# EAGLE design SECUREBRD_003 (EAGLE 7.7.0)

## Sheet 1 of 3
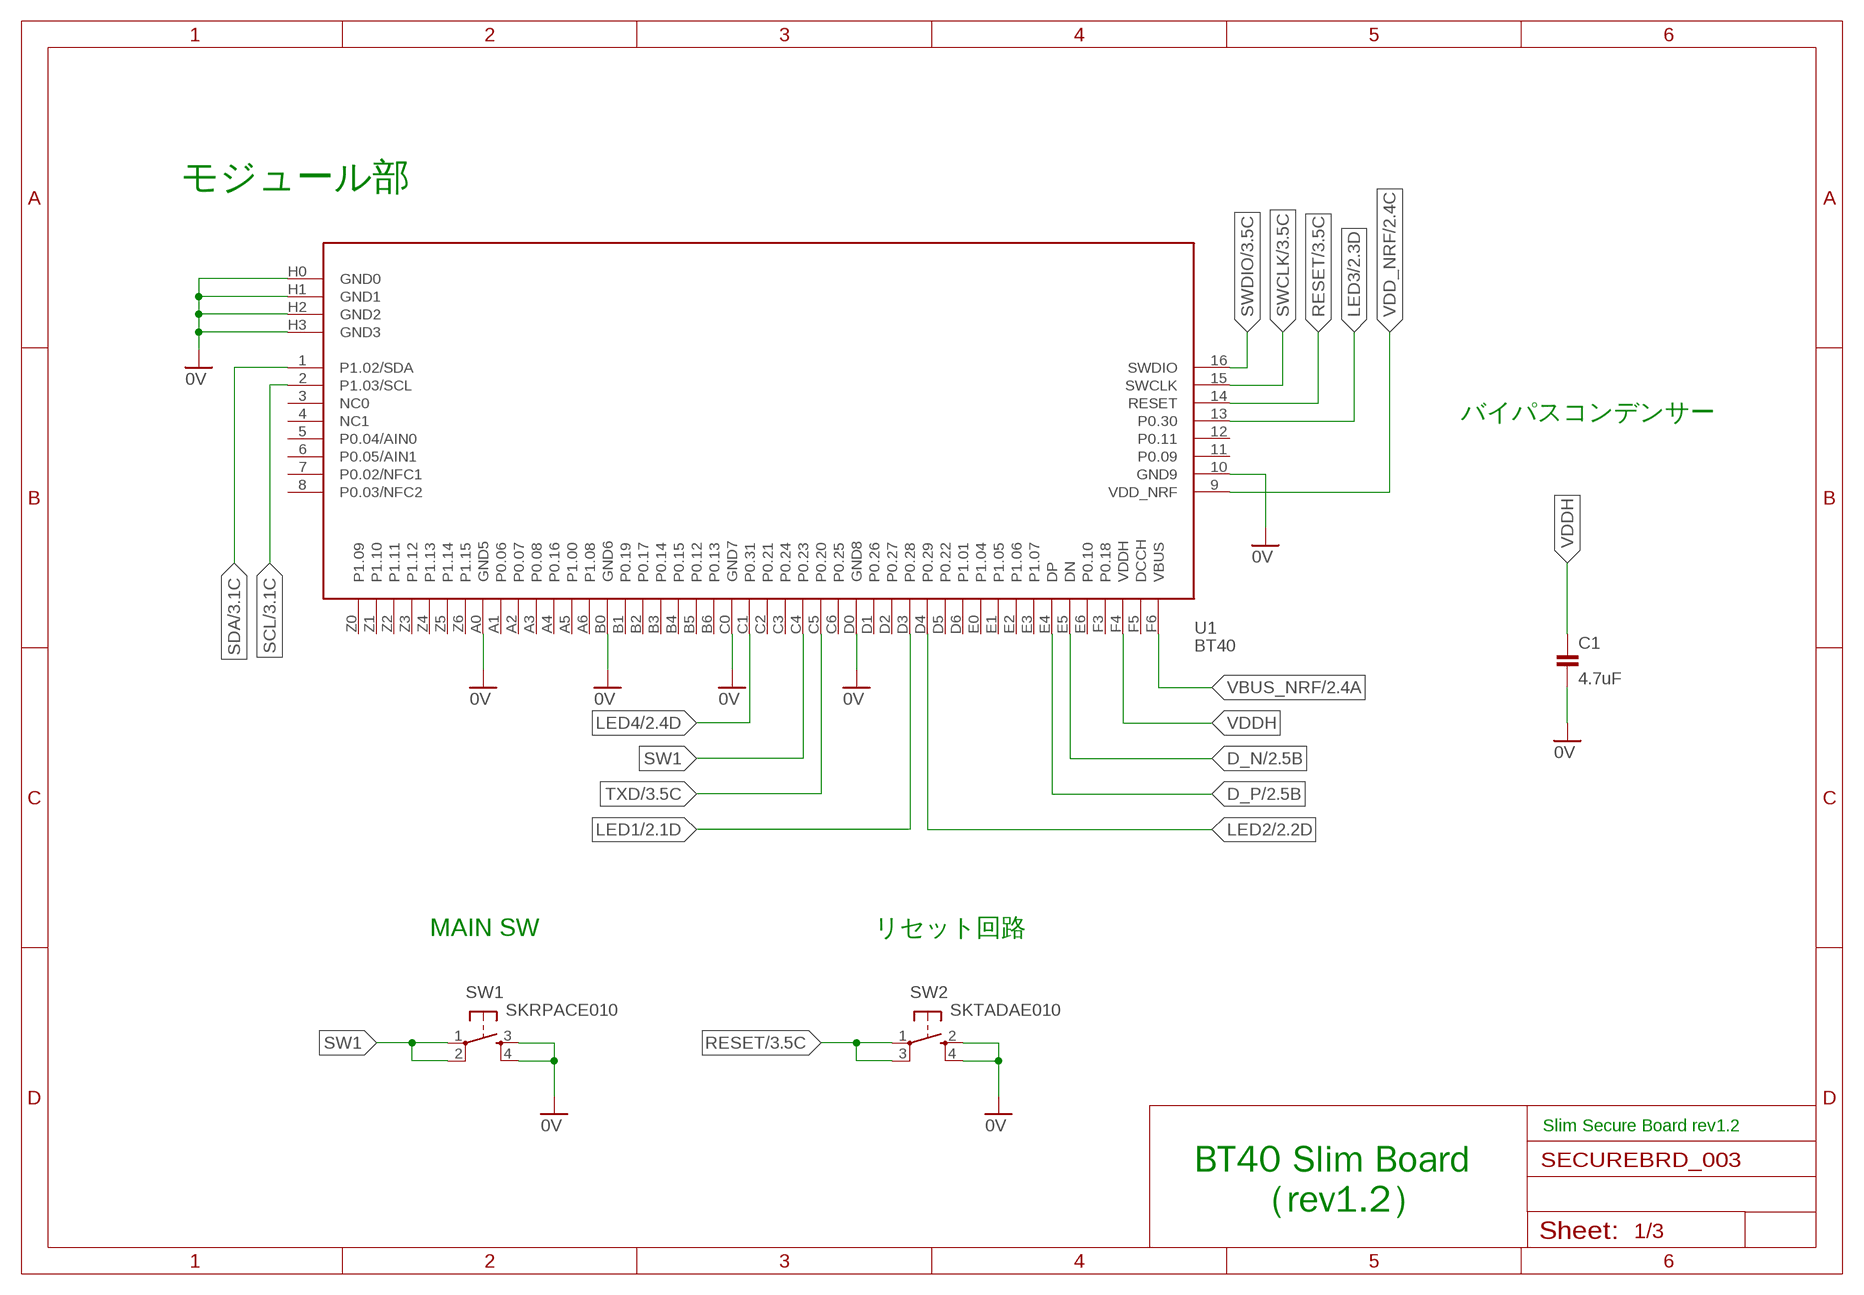
[diagram p0: schematic, sheet 1]

### Parts
C1  4.7uF  CAP_0603  [C0603K]
SW1  SKRPACE010  [SKRPACE010]
SW2  SKTADAE010  [SKTADAE010]
U1  BT40  [BM40-B_1PRIMARY]

### Nets
0V: C1.2 SW1.3(S) SW1.4(S1) SW2.2(S) SW2.4(S1) U1.10(GND9) U1.A0(GND5) U1.B0(GND6) U1.C0(GND7) U1.D0(GND8) U1.H0(GND0) U1.H1(GND1) U1.H2(GND2) U1.H3(GND3) ; also sheet 2,3
D_N: U1.E5(DN) ; also sheet 2
D_P: U1.E4(DP) ; also sheet 2
LED1: U1.D3(P0.28) ; also sheet 2
LED2: U1.D4(P0.29) ; also sheet 2
LED3: U1.13(P0.30) ; also sheet 2
LED4: U1.C1(P0.31) ; also sheet 2
RESET: SW2.1(P) SW2.3(P1) U1.14(RESET) ; also sheet 3
SCL: U1.2(P1.03/SCL) ; also sheet 3
SDA: U1.1(P1.02/SDA) ; also sheet 3
SW1: SW1.1(P) SW1.2(P1) U1.C4(P0.23)
SWCLK: U1.15(SWCLK) ; also sheet 3
SWDIO: U1.16(SWDIO) ; also sheet 3
TXD: U1.C5(P0.20) ; also sheet 3
VBUS_NRF: U1.F6(VBUS) ; also sheet 2
VDD_NRF: U1.9(VDD_NRF) ; also sheet 2,3
VDDH: C1.1 U1.F4(VDDH)
Unconnected: U1.3(NC0) U1.4(NC1) U1.5(P0.04/AIN0) U1.6(P0.05/AIN1) U1.7(P0.02/NFC1) U1.8(P0.03/NFC2) U1.11(P0.09) U1.12(P0.11) U1.A1(P0.06) U1.A2(P0.07) U1.A3(P0.08) U1.A4(P0.16) U1.A5(P1.00) U1.A6(P1.08) U1.B1(P0.19) U1.B2(P0.17) U1.B3(P0.14) U1.B4(P0.15) U1.B5(P0.12) U1.B6(P0.13) U1.C2(P0.21) U1.C3(P0.24) U1.C6(P0.25) U1.D1(P0.26) U1.D2(P0.27) U1.D5(P0.22) U1.D6(P1.01) U1.E0(P1.04) U1.E1(P1.05) U1.E2(P1.06) U1.E3(P1.07) U1.E6(P0.10) U1.F3(P0.18) U1.F5(DCCH) U1.Z0(P1.09) U1.Z1(P1.10) U1.Z2(P1.11) U1.Z3(P1.12) U1.Z4(P1.13) U1.Z5(P1.14) U1.Z6(P1.15)

### Notes on the sheet
- モジュール部
- バイパスコンデンサー
- MAIN SW | リセット回路
- Slim Secure Board rev1.2
- BT40 Slim Board
       （rev1.2）

## Sheet 2 of 3
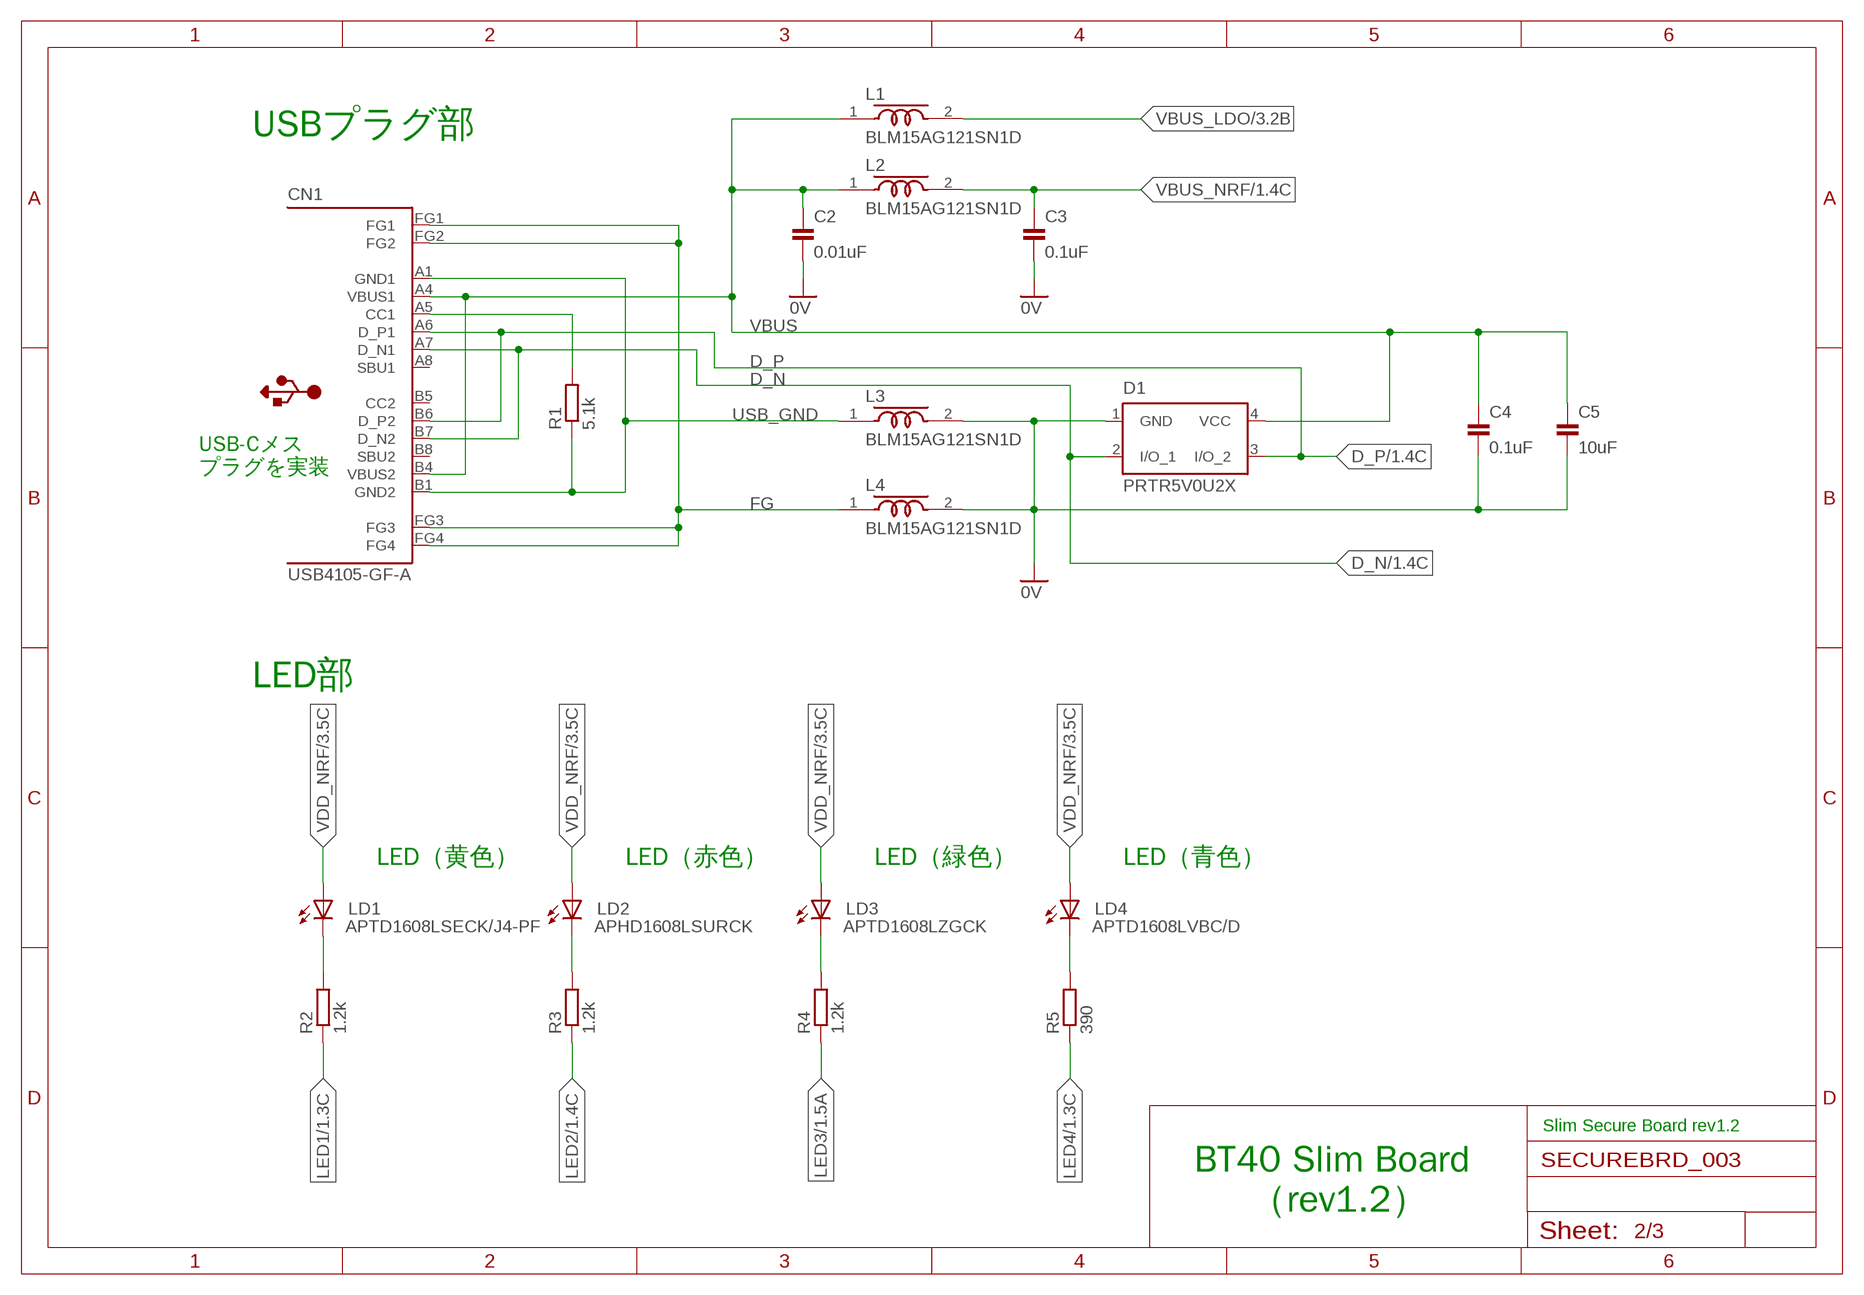
[diagram p1: schematic, sheet 2]

### Parts
C2  0.01uF  CAP_0402K  [C0402K]
C3  0.1uF  CAP_0402K  [C0402K]
C4  0.1uF  CAP_0402K  [C0402K]
C5  10uF  CAP_0603  [C0603K]
CN1  USB4105-GF-A  [USB4105-GF-A]
D1  PRTR5V0U2X  [SOT143B]
L1  BLM15AG121SN1D  [C0402K]
L2  BLM15AG121SN1D  [C0402K]
L3  BLM15AG121SN1D  [C0402K]
L4  BLM15AG121SN1D  [C0402K]
LD1  APTD1608LSECK/J4-PF  [APTD1608]
LD2  APHD1608LSURCK  [APTD1608]
LD3  APTD1608LZGCK  [APTD1608]
LD4  APTD1608LVBC/D  [APTD1608]
R1  5.1k  RESISTOR_0402  [R0402]
R2  1.2k  RESISTOR_0402  [R0402]
R3  1.2k  RESISTOR_0402  [R0402]
R4  1.2k  RESISTOR_0402  [R0402]
R5  390  RESISTOR_0402  [R0402]

### Nets
0V: C2.2 C3.2 C4.2 C5.2 D1.1(GND) L3.2 L4.2 ; also sheet 1,3
D_N: CN1.A7(D_N1) CN1.B7(D_N2) D1.2(I/O_1) ; also sheet 1
D_P: CN1.A6(D_P1) CN1.B6(D_P2) D1.3(I/O_2) ; also sheet 1
FG: CN1.FG1 CN1.FG2 CN1.FG3 CN1.FG4 L4.1
LED1: R2.1 ; also sheet 1
LED2: R3.1 ; also sheet 1
LED3: R4.1 ; also sheet 1
LED4: R5.1 ; also sheet 1
N$1: LD4.C R5.2
N$2: CN1.A5(CC1) R1.2
N$6: LD3.C R4.2
N$7: LD2.C R3.2
N$8: LD1.C R2.2
USB_GND: CN1.A1(GND1) CN1.B1(GND2) L3.1 R1.1
VBUS: C2.1 C4.1 C5.1 CN1.A4(VBUS1) CN1.B4(VBUS2) D1.4(VCC) L1.1 L2.1
VBUS_LDO: L1.2 ; also sheet 3
VBUS_NRF: C3.1 L2.2 ; also sheet 1
VDD_NRF: LD1.A LD2.A LD3.A LD4.A ; also sheet 1,3
Unconnected: CN1.A8(SBU1) CN1.B5(CC2) CN1.B8(SBU2)

### Notes on the sheet
- USBプラグ部
- USB-Cメス
  プラグを実装
- LED部
- LED（黄色） | LED（赤色） | LED（緑色） | LED（青色）
- Slim Secure Board rev1.2
- BT40 Slim Board
       （rev1.2）

## Sheet 3 of 3
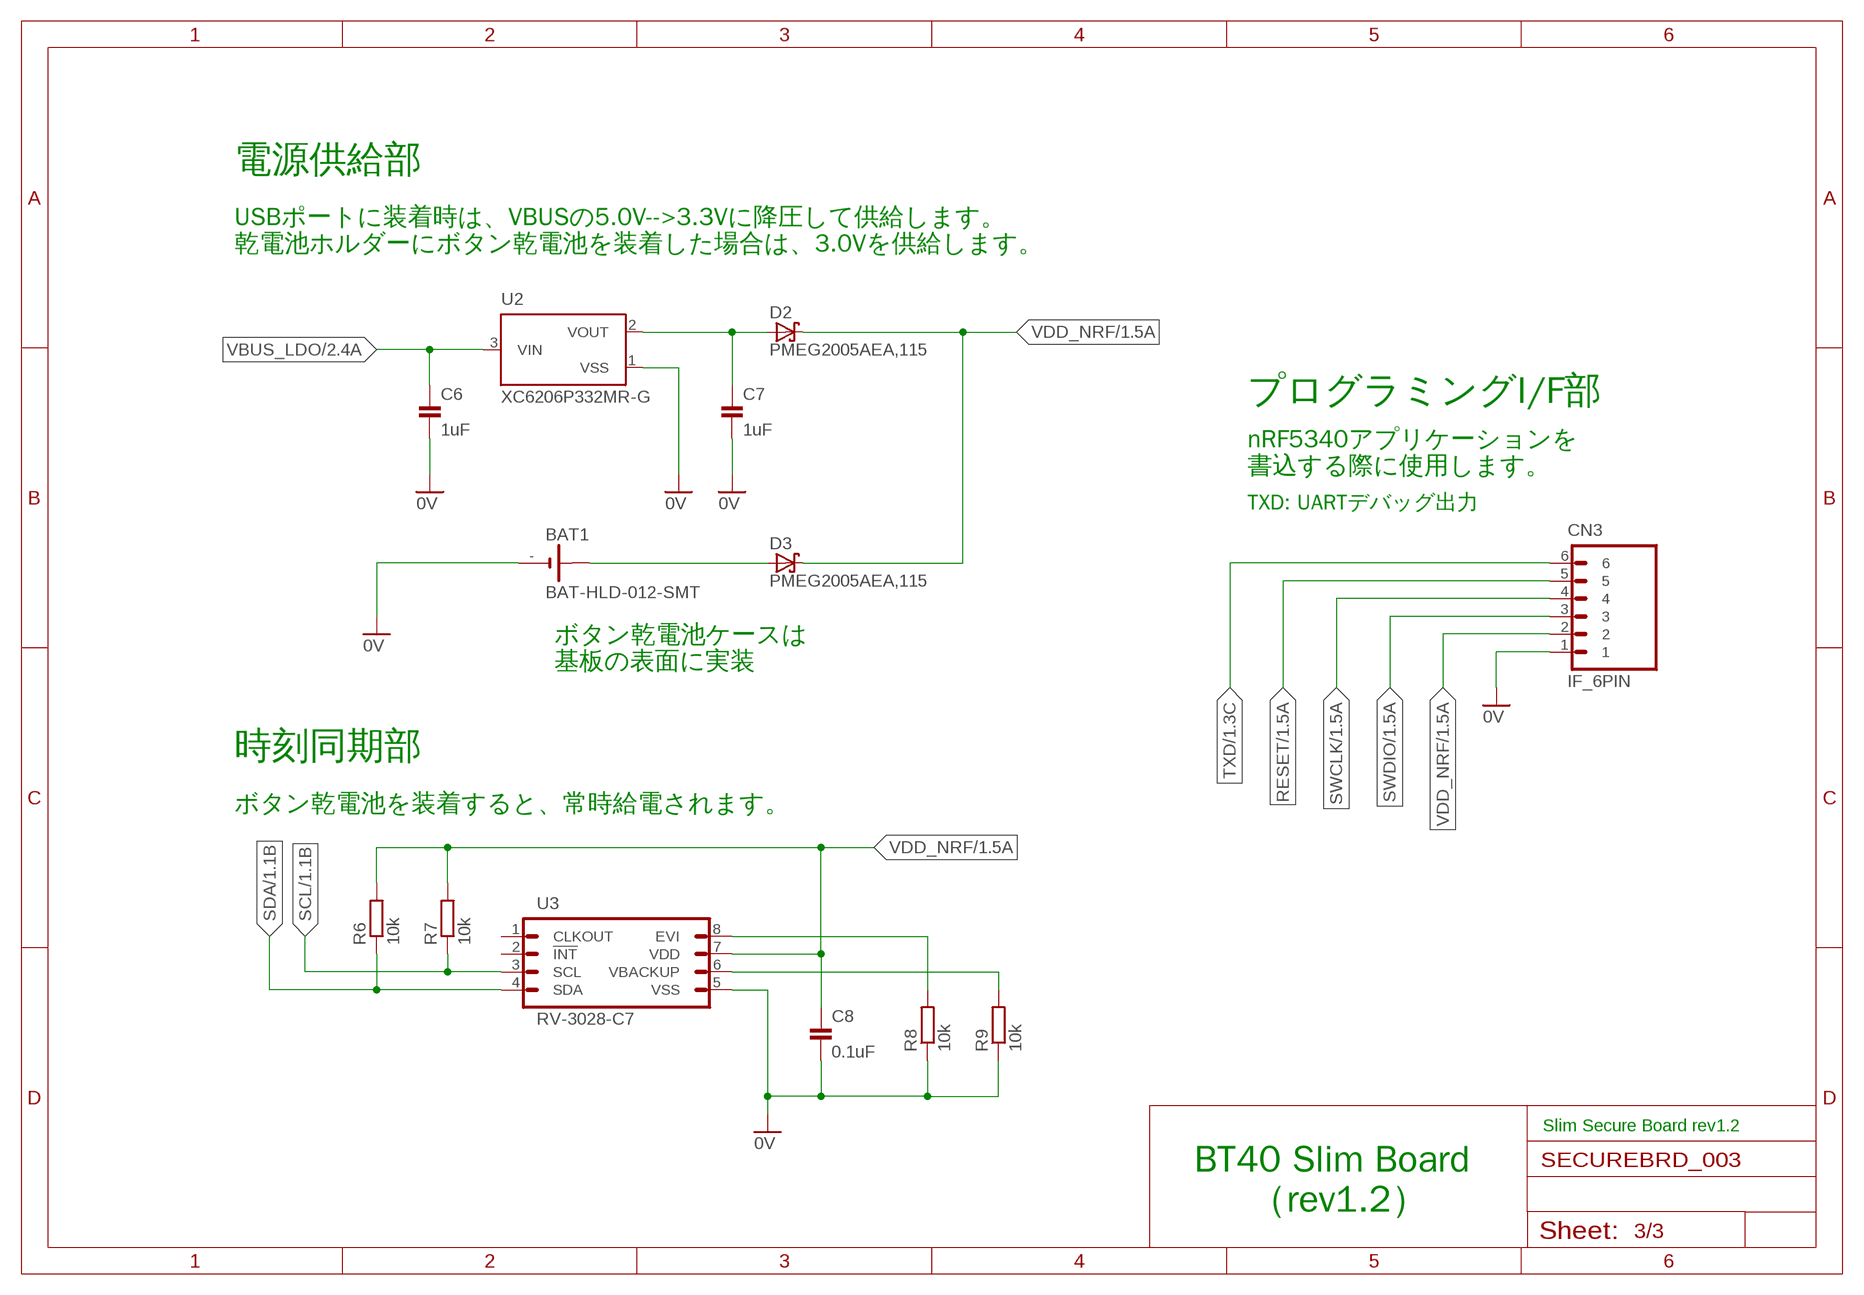
[diagram p2: schematic, sheet 3]

### Parts
BAT1  BAT-HLD-012-SMT  [BAT-HLD-012-SMT]
C6  1uF  CAP_0603  [C0603K]
C7  1uF  CAP_0603  [C0603K]
C8  0.1uF  CAP_0402K  [C0402K]
CN3  IF_6PIN  [HEADER_6PIN]
D2  PMEG2005AEA,115  [SOD323-W]
D3  PMEG2005AEA,115  [SOD323-W]
R6  10k  RESISTOR_0402  [R0402]
R7  10k  RESISTOR_0402  [R0402]
R8  10k  RESISTOR_0402  [R0402]
R9  10k  RESISTOR_0402  [R0402]
U2  XC6206P332MR-G  [SOT23]
U3  RV-3028-C7  [SON-8]

### Nets
0V: BAT1.- C6.2 C7.2 C8.2 CN3.1 R8.1 R9.1 U2.1(VSS) U3.5(VSS) ; also sheet 1,2
N$4: C7.1 D2.A U2.2(VOUT)
N$9: R9.2 U3.6(VBACKUP)
N$10: R8.2 U3.8(EVI)
RESET: CN3.5 ; also sheet 1
SCL: R7.1 U3.3(SCL) ; also sheet 1
SDA: R6.1 U3.4(SDA) ; also sheet 1
SWCLK: CN3.4 ; also sheet 1
SWDIO: CN3.3 ; also sheet 1
TXD: CN3.6 ; also sheet 1
VBUS_LDO: C6.1 U2.3(VIN) ; also sheet 2
VDD_BAT: BAT1.+@2(+) D3.A
VDD_NRF: C8.1 CN3.2 D2.C D3.C R6.2 R7.2 U3.7(VDD) ; also sheet 1,2
Unconnected: U3.1(CLKOUT) U3.2(!INT!)

### Notes on the sheet
- 電源供給部
- USBポートに装着時は、VBUSの5.0V-->3.3Vに降圧して供給します。
  乾電池ホルダーにボタン乾電池を装着した場合は、3.0Vを供給します。
- プログラミングI/F部
- nRF5340アプリケーションを
  書込する際に使用します。
- TXD: UARTデバッグ出力
- ボタン乾電池ケースは
  基板の表面に実装
- 時刻同期部
- ボタン乾電池を装着すると、常時給電されます。
- Slim Secure Board rev1.2
- BT40 Slim Board
       （rev1.2）

## Library data of the parts
BAT1 = Connectors:BAT-HLD-012-SMT: ボタン電池ホルダー(CR1216/1225)
C1-C8 = Parts:CAP: コンデンサー
CN1 = Connectors:USB4105-GF-A: USB Type C Receptacle for USB 2.0
CN3 = Connectors:IF_6PIN: 6-pin インターフェース
D1 = Parts:PRTR5V0U2X: ESD protection diode
D2 D3 = Parts:PMEG2005: ショットキーダイオード If - 順電流: 500 mA Vrrm - 繰返し逆電圧: 20 V Vf - 順電圧: 0.39 V Ifsm - 順方向サージ電流: 10 A 最低動作温度: - 65 C 最高動作温度: + 150 C
L1-L4 = Parts:BLM15AG: フェライトビーズ EMIFIL®
LD1 LD3 LD4 = Parts:APTD1608: 発光ダイオード
LD2 = Parts:APHD1608: 発光ダイオード
R1-R9 = Parts:RESISTOR: 抵抗器
SW1 = Parts:SKRPACE010: 表面実装用タクトスイッチ ４．２×３．２ｍｍ小型重作動力タイプ ・作動力：２．５５Ｎ ・操作方向：垂直 ・移動量：０．２ｍｍ ・動作寿命：５０，０００ｃｙｃｌｅｓ （５ｍＡ ５ＶＤＣ） ・初期接触抵抗：最大５００ｍΩ
SW2 = Parts:SKTADAE010: 表面実装用タクトスイッチ 2.6×1.6ｍｍ小型重作動力タイプ ・作動力：2.4 N ・操作方向：垂直 ・移動量：0.11 mm ・定格：50 mA 12 VDC
U1 = Modules:BT40: BLE 5.2, 802.15.4 Modules ・nRF5340 QKAA, dual core ARM® Cortex M33 ・128/64 MHz Cortex M33 with FPU and DSP instructions ・1MB flash, 512KB RAM ・DC-DC converter, inductors for VDD, VDDH on board. ・Direct powered by Lithium batteries or USB supply (up to 5.5V)
U2 = Parts:XC6206: 電圧レギュレータ 出力電圧: 3.3 V 出力電流: 200 mA 入力電圧最大値: 6 V 最小入力電圧: 1.8 V 動作供給電流: 1 uA 最低動作温度: - 40 C 最高動作温度: + 85 C
U3 = ICs:RV-3028-C7: Extreme Low Power RTC Module Supply Voltage: 1.2 V 〜 5.5 V Operating Temperature: - 40 C 〜 + 85 C 3.2 mm x 1.5 mm

## Board
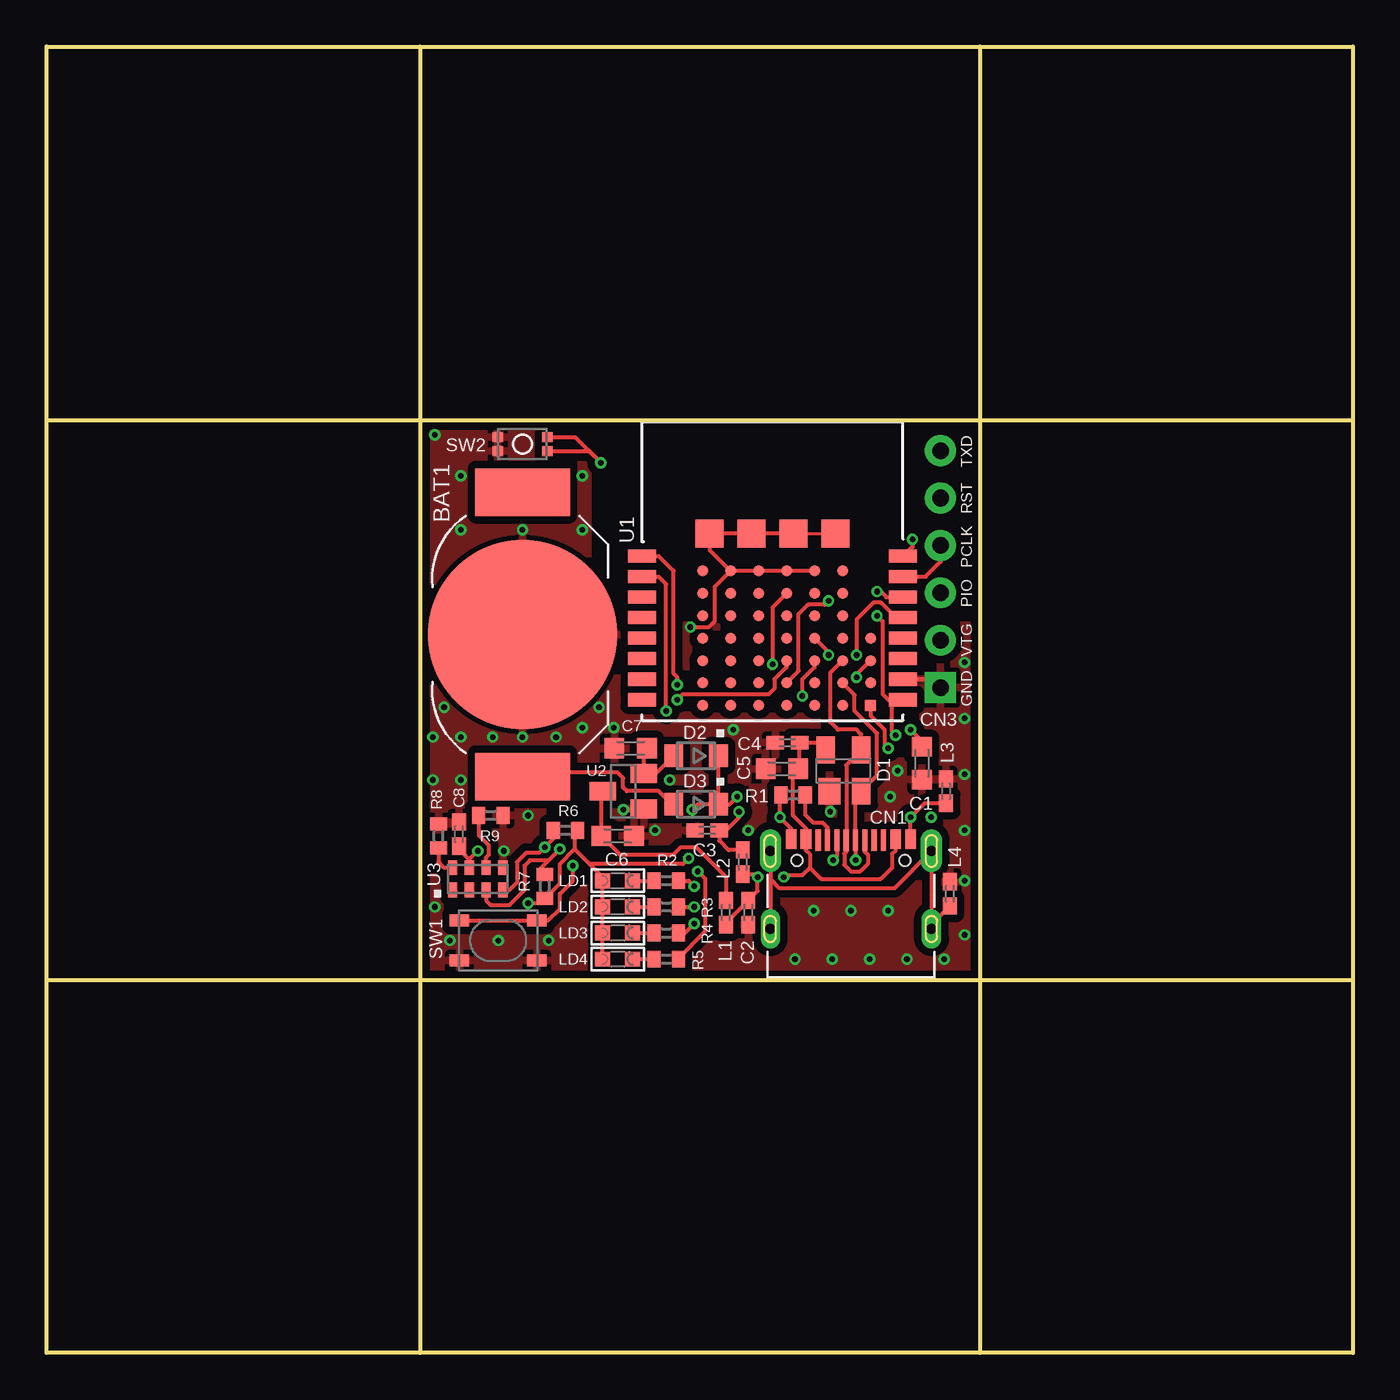
[diagram p3: board, top side]
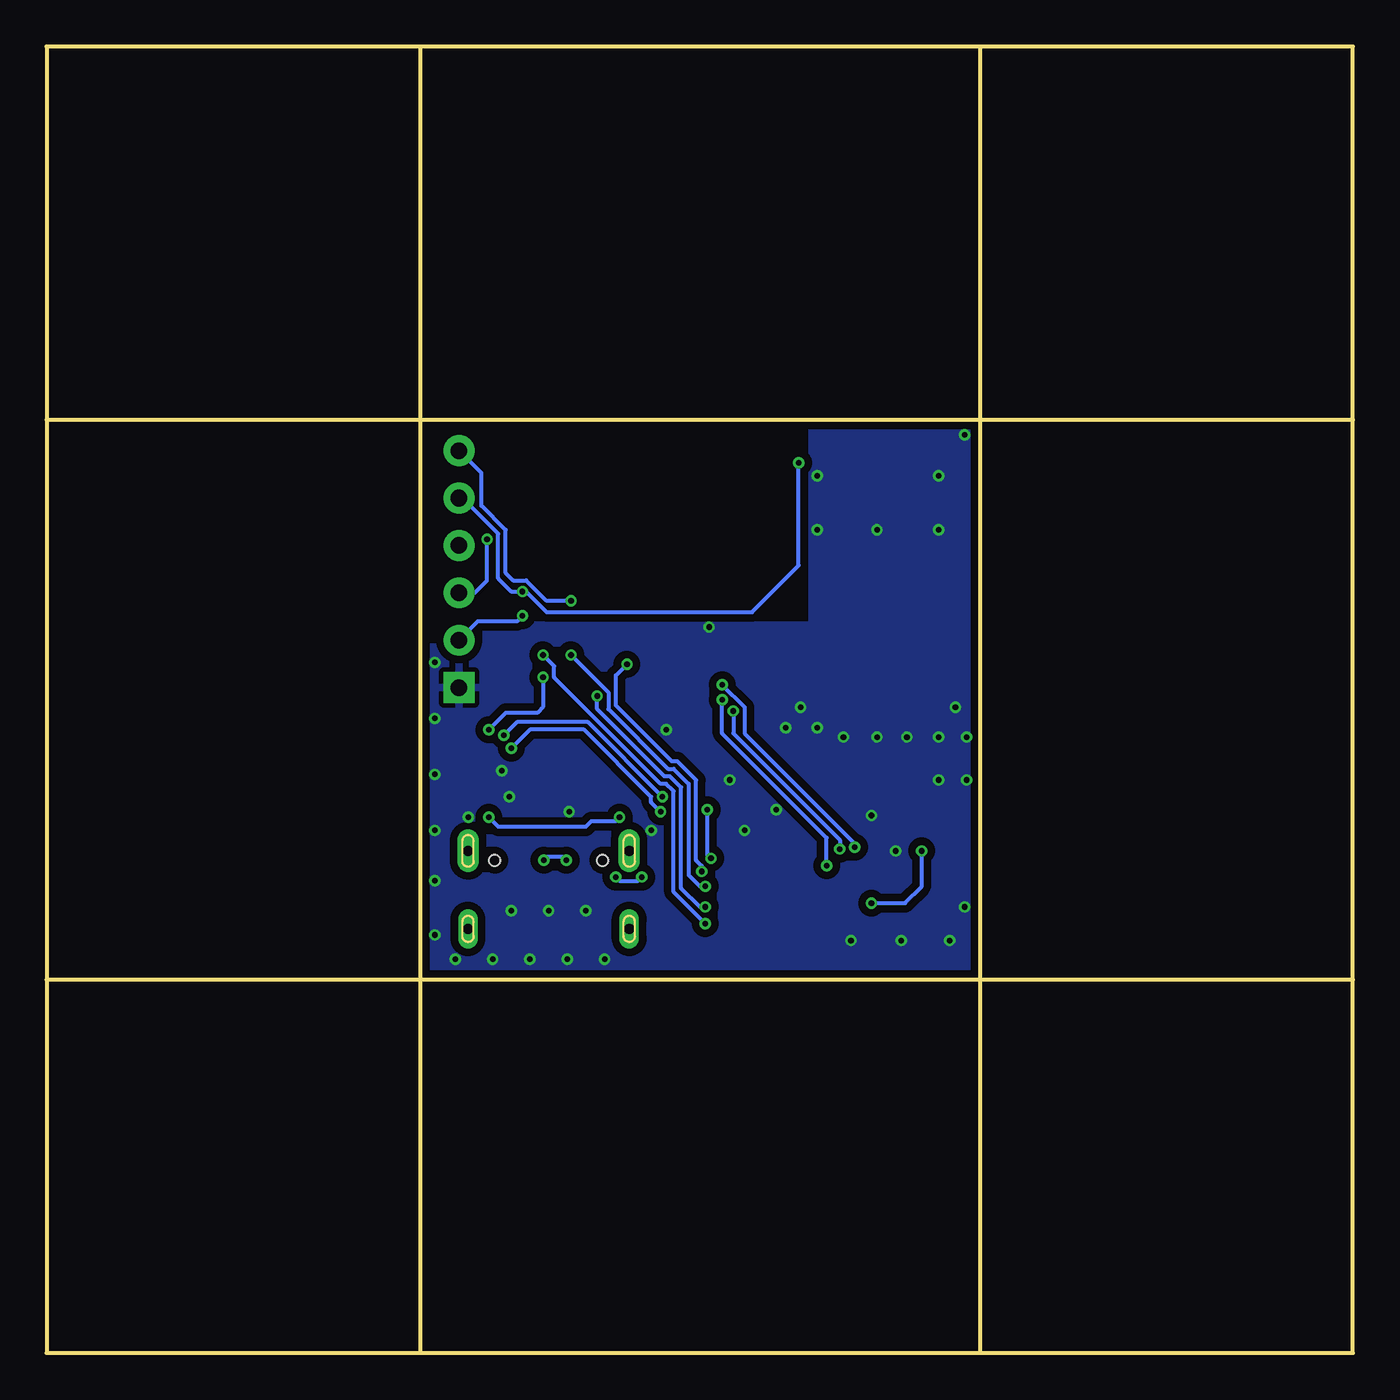
[diagram p4: board, bottom side, seen from below]

Size 70 x 70 mm. Coordinates in mm from the lower left corner, seen from the top.
Outline: 0,20 0,0 20,0
Outline: 0,20 0,50
Outline: 0,50 0,70 20,70
Outline: 20,70 50,70
Outline: 50,70 70,70 70,50
Outline: 70,50 70,20
Outline: 70,20 70,0 50,0
Outline: 50,0 20,0
Outline: 0,50 70,50
Outline: 0,20 70,20
Outline: 20,70 20,0
Outline: 50,70 50,0
Copper layers (1*16): Top 0.035mm / dielectric 1.5mm / Bottom 0.035mm
Design rules "SeeedStudio_2layer_DRU_no_angle_20140221 *": minimum track width 6mil, minimum drill 0.3mm, track to track 6mil, track to pad 6mil, pad to pad 6mil, via to via 6mil, smd to smd 0mil, copper to edge 10mil, drill to drill 10mil, minimum pad ring 4mil, minimum via ring 6mil, stop-mask expansion 2mil, vias tented up to drill 100mil, thermal gap 10mil

### Footprints (pad centres in the part's own frame; a part is rotated, then mirrored left to right if it is on the bottom)
BAT-HLD-012-SMT = smd 2.54 x 5.08: +@1 -7.62,0; +@2 7.62,0 | smd 10.16 x 10.16: - 0,0
C0603K = smd 1.05 x 1.08: 1 -0.875,0; 2 0.875,0
C0402K = smd 0.925 x 0.74: 1 -0.65,0; 2 0.65,0
USB4105-GF-A = smd 0.58 x 1.05: A1 -3.2,0.625; A4 -2.4,0.625; B1 3.2,0.625; B4 2.4,0.625 | smd 0.28 x 1.15: A5 -1.25,0.575; A6 -0.25,0.575; A7 0.25,0.575; A8 1.25,0.575; B5 1.75,0.575; B6 0.75,0.575; B7 -0.75,0.575; B8 -1.75,0.575 | drill 0.55 pad 1.15 long: FG1 -4.32,0; FG3 4.32,0 | drill 0.55 pad 1.05 long: FG2 -4.32,-4.18; FG4 4.32,-4.18 | hole 0.6: -2.89,-0.5; 2.89,-0.5
HEADER_6PIN = drill 0.889 pad 1.651 square: 1 -6.35,0 | drill 0.889 pad 1.651: 2 -3.81,0; 3 -1.27,0; 4 1.27,0; 5 3.81,0; 6 6.35,0
SOT143B = smd 1.2 x 1.44: 1 -0.75,-1.1 | smd 1 x 1.44: 2 0.95,-1.1; 3 0.95,1.1; 4 -0.95,1.1
SOD323-W = smd 1 x 1.2: A 1.2,0; C -1.2,0
APTD1608 = smd 0.8 x 0.8: A -0.8,0; C 0.8,0
R0402 = smd 0.7 x 0.9: 1 -0.65,0; 2 0.65,0
SKRPACE010 = smd 1.05 x 0.65: 1 -2.075,1.075; 2 2.075,1.075; 3 -2.075,-1.075; 4 2.075,-1.075
SKTADAE010 = smd 0.55 x 0.55: 1 -1.325,0.375; 2 1.325,0.375; 3 -1.325,-0.375; 4 1.325,-0.375
BM40-B_1PRIMARY = smd 1.5 x 0.7: 1 0,8.8; 2 0,7.7; 3 0,6.6; 4 0,5.5; 5 0,4.4; 6 0,3.3; 7 0,2.2; 8 0,1.1; 9 14,1.1; 10 14,2.2; 11 14,3.3; 12 14,4.4; 13 14,5.5; 14 14,6.6; 15 14,7.7; 16 14,8.8 | smd 0.6 x 0.6: A0 4.75,8; A1 4.75,6.8; A2 4.75,5.6; A3 4.75,4.4; A4 4.75,3.2; A5 4.75,2; A6 4.75,0.8; B0 6.25,8; B1 6.25,6.8; B2 6.25,5.6; B3 6.25,4.4; B4 6.25,3.2; B5 6.25,2; B6 6.25,0.8; C0 7.75,8; C1 7.75,6.8; C2 7.75,5.6; C3 7.75,4.4; C4 7.75,3.2; C5 7.75,2; C6 7.75,0.8; D0 9.25,8; D1 9.25,6.8; D2 9.25,5.6; D3 9.25,4.4; D4 9.25,3.2; D5 9.25,2; D6 9.25,0.8; E0 10.75,8; E1 10.75,6.8; E2 10.75,5.6; E3 10.75,4.4; E4 10.75,3.2; E5 10.75,2; E6 10.75,0.8; F3 12.25,4.4; F4 12.25,3.2; F5 12.25,2; F6 12.25,0.8; Z0 3.25,8; Z1 3.25,6.8; Z2 3.25,5.6; Z3 3.25,4.4; Z4 3.25,3.2; Z5 3.25,2; Z6 3.25,0.8 | smd 1.5 x 1.5: H0 3.625,10; H1 5.875,10; H2 8.125,10; H3 10.375,10
SOT23 = smd 1 x 1.4: 1 -0.95,-1.1; 2 0.95,-1.1; 3 0,1.1
SON-8 = smd 0.5 x 0.8: 1 0.25,0.4; 2 1.15,0.4; 3 2.05,0.4; 4 2.95,0.4; 5 2.95,1.6; 6 2.05,1.6; 7 1.15,1.6; 8 0.25,1.6

### Placement (x,y rotation side)
BAT1  25.5,38.5 270 top
C1  46.9,31.6 270 top
C2  37.6,23.6 270 top
C3  35.4,28 180 top
C4  39.7,32.7 180 top
C5  39.4,31.3 180 top
C6  30.6,27.7 0 top
C7  31.3,32.4 180 top
C8  22.1,27.8 90 top
CN1  43.1,26.9 0 top
CN3  47.9,42 90 top
D1  42.7,31.2 0 top
D2  34.8,32 180 top
D3  34.8,29.4 180 top
L1  36.4,23.6 90 top
L2  37.3,26.3 90 top
L3  48.2,30.1 90 top
L4  48.4,24.6 90 top
LD1  30.6,25.3 0 top
LD2  30.6,23.9 0 top
LD3  30.6,22.5 0 top
LD4  30.6,21.1 0 top
R1  40,29.9 0 top
R2  33.2,25.3 180 top
R3  33.2,23.9 180 top
R4  33.2,22.5 180 top
R5  33.2,21.1 180 top
R6  27.8,28 0 top
R7  26.7,25 270 top
R8  21,27.7 270 top
R9  23.8,28.8 180 top
SW1  24.2,22.1 0 top
SW2  25.5,48.7 180 top
U1  31.9,33.9 0 top
U2  30.9,30.1 90 top
U3  21.5,24.4 0 top

### Tracks (layer width: path | path; a pad name or v marks a point on that pad's centre or on a via)
0V  (via drill 0.3)
  Top 0.152: U1.H2 U1.H3
  Top 0.203: U1.A0 35.8,41.05 35.8,39.2 35.5,38.9 v34.5,38.9 | U1.D0 U1.C0 U1.B0 U1.A0 | U1.A0 35.52,43.02 U1.H0 U1.H1 U1.H2 | U1.10 47.45,36.1 CN3.1 | U2.1 32.15,29.15 32.1,29.1 v30.9,29.1 | 31.68,27.5 C6.2
  other vias: 42,29 49.2,28 32.6,28 36.8,33.4 45.2,29.8 42.1,21.1 46.1,21.1 40.1,21.1 44.1,21.1 43.1,23.7 45.1,23.7 41.1,23.7 45.6,31.2 48.1,21.1 30.4,33.5 22.2,33 22.2,30.7 20.8,23.9 26.9,22.1 24.2,22.1 21.6,22.1 24.5,26.9 25.8,28.8 27.3,33 49.2,37 49.2,34 49.2,31 49.2,25.3 49.2,22.4 28.7,33.5 25.5,33 20.7,30.7 20.7,33 21.3,34.6 29.6,34.6 22.2,44.1 25.5,44.1 28.7,44.1 28.7,47 22.2,47 20.8,49.2 37.6,28 47.4,28.7 33.4,30.7 23.9,33
  pour Bottom (isolate 0.406, rank 3): 29,51 29,39 51,39 51,19 19,19 19,51
  pour Top (isolate 0.406, rank 3): 18,52 29,52 29,39 52,39 52,18 18,18
D_N  (via drill 0.3)
  Top 0.203: v43.35,26.4 CN1.A7 43.35,29.8 D1.2 44.5,30.95 44.5,33.2 43.3,34.4 43.3,35.25 U1.E5 | CN1.B7 42.35,26.6 v42.15,26.4
  Bottom 0.203: v42.15,26.4 42.35,26.6 43.15,26.6 v43.35,26.4
D_P
  Top 0.203: CN1.B6 43.85,26.85 44,26.7 44,26.2 43.6,25.8 43.1,25.8 42.75,26.15 42.75,26.75 42.85,26.85 CN1.A6 42.85,31.5 D1.3 43.65,33.15 43.4,33.4 42.4,33.4 42,33.8 42,36.45 U1.E4
FG
  Top 0.203: 38.78,25.4 CN1.FG1 38.78,26.82 | 38.78,25.4 CN1.FG2 | 38.78,25.4 39.28,24.9 45.42,24.9 CN1.FG3 CN1.FG4 47.42,22.97 L4.1
LED1  (via drill 0.3)
  Top 0.203: R2.1 34.4,25.3 v34.7,25 | v41.9,37.4 41.9,37.55 U1.D3
  Bottom 0.203: v41.9,37.4 39.9,35.4 39.9,34.5 36.7,31.3 36.4,31.3 35.6,30.5 35.6,25.6 35,25 v34.7,25
LED2  (via drill 0.3)
  Top 0.203: R3.1 v34.7,23.9 | v40.5,35.2 40.5,36.1 41.15,36.75 U1.D4
  Bottom 0.203: v34.7,23.9 35,23.9 36,24.9 36,30.3 36.6,30.9 36.9,30.9 40.5,34.5 v40.5,35.2
LED3  (via drill 0.3)
  Top 0.203: R4.1 34.2,22.5 v34.7,23 | U1.13 45.5,39.4 44.7,40.2 44.3,40.2 43.4,39.3 v43.4,37.4
  Bottom 0.203: v34.7,23 36.4,24.7 36.4,30.1 36.8,30.5 37.1,30.5 42.8,36.2 42.8,36.8 v43.4,37.4
LED4  (via drill 0.3)
  Top 0.203: R5.1 33.85,21.15 35.3,22.6 35.3,25.4 v34.9,25.8 | U1.C1 38.9,39.95 v38.9,36.9
  Bottom 0.203: v34.9,25.8 34.9,26.1 35.2,26.4 35.2,30.7 36.2,31.7 36.5,31.7 39.5,34.7 39.5,36.3 v38.9,36.9
N$1
  Top 0.203: LD4.C R5.2
N$2
  Top 0.203: CN1.A5 41.85,28.15 41.6,28.4 41.1,28.4 40.65,28.85 R1.2
N$4
  Top 0.203: D2.A 32.65,31.05 U2.2 32,32.23 C7.1
N$6
  Top 0.203: LD3.C R4.2
N$7
  Top 0.203: LD2.C R3.2
N$8
  Top 0.203: LD1.C R2.2
N$9
  Top 0.203: U3.6 23.55,26.55 23.7,26.7 23.7,27.2 23.15,27.75 R9.2
N$10
  Top 0.203: U3.8 21.3,26 21,26.3 R8.2
RESET  (via drill 0.3)
  Top 0.203: SW2.3 28.32,49.08 v29.7,47.7 29.07,48.33 SW2.1 | v44.5,40.8 44.7,40.8 45,40.5 U1.14
  Bottom 0.203: v29.7,47.7 29.7,42.2 32.2,39.7 43.2,39.7 44.3,40.8 v44.5,40.8 45.1,40.8 45.8,41.5 45.8,43.9 47.71,45.81 CN3.5
SCL  (via drill 0.3)
  Top 0.203: U3.3 23.55,24.25 23.8,24 24.8,24 25.6,24.8 25.6,26.1 25.9,26.4 26.9,26.4 | 26.9,26.4 26.5,26 R7.1 | v33.2,34.4 33.2,41.2 32.8,41.6 U1.2 | 26.9,26.4 v27.5,27
  Bottom 0.203: v33.2,34.4 33.2,33.2 27.5,27.5 v27.5,27
SDA  (via drill 0.3)
  Top 0.203: U3.4 24.8,24.8 25.2,25.2 25.2,26.3 25.7,26.8 26.4,26.8 v26.7,27.1 27.15,27.55 R6.1 | v33.8,35.8 33.8,36.2 33.6,36.4 33.6,41.9 32.8,42.7 U1.1
  Bottom 0.203: v33.8,35.8 32.6,34.6 32.6,33.2 26.7,27.3 v26.7,27.1
SW1  (via drill 0.3)
  Top 0.203: SW1.1 SW1.2 26.88,23.18 27.5,23.8 27.5,24.6 28.2,25.3 v28.2,26.1 | v33.8,35 34.1,35.3 38.7,35.3 39,35.6 39,36.1 39.65,36.75 U1.C4
  Bottom 0.203: v33.8,35 33.8,33.2 28.2,27.6 v28.2,26.1
SWCLK
  Top 0.203: U1.15 47.1,41.6 47.9,42.4 CN3.4
SWDIO  (via drill 0.3)
  Top 0.203: v46.4,43.6 46.4,43.2 U1.16
  Bottom 0.203: v46.4,43.6 46.4,41.4 47.07,40.73 CN3.3
TXD  (via drill 0.3)
  Top 0.203: U1.C5 40.3,36.55 40.3,39.6 40.8,40.1 41.7,40.1 v41.9,40.3
  Bottom 0.203: v41.9,40.3 43.2,40.3 44.3,41.4 45,41.4 45.4,41.8 45.4,44.1 46.7,45.4 46.7,47.15 CN3.6
USB_GND  (via drill 0.3)
  Top 0.203: CN1.B1 v46.3,28.7 | 46.5,28.9 v46.3,28.7 | CN1.A1 39.9,28.1 v39.3,28.7 39.3,29.85 R1.1 | L3.1 47.05,29.45 v46.3,28.7
  Bottom 0.203: v46.3,28.7 45.8,28.2 41.1,28.2 40.8,28.5 39.5,28.5 v39.3,28.7
VBUS  (via drill 0.3)
  Top 0.203: 40.9,26 40.9,26.73 40.7,26.93 CN1.A4 40.7,28.1 40,28.8 40,31.02 C5.1 40.35,31.38 C4.1 41.35,32.7 D1.4 | 40.9,26 41.5,25.4 44.7,25.4 45.3,26 45.3,26.73 45.5,26.93 CN1.B4 | 40.9,26 40.5,25.6 39.6,25.6 v39.5,25.5 | L2.1 37.95,25.65 v38.1,25.5 38.1,24.75 C2.1 36.4,23.05 L1.1
  Bottom 0.203: v38.1,25.5 38.3,25.3 39.3,25.3 v39.5,25.5
VBUS_LDO
  Top 0.203: U2.3 29.73,30.02 C6.1 30.73,26.7 33.6,26.7 34,27.1 34.8,27.1 36.4,25.5 L1.2
VBUS_NRF  (via drill 0.3)
  Top 0.203: U1.F6 44.15,34.15 44.9,33.4 44.9,32.6 v45.1,32.4 | v37.1,29 37.1,28.7 36.4,28 C3.1 36.05,27.45 36.55,26.95 L2.2
  Bottom 0.203: v37.1,29 37.6,29.5 37.6,29.8 41.2,33.4 44.1,33.4 v45.1,32.4
VDD_BAT
  Top 0.203: 24.75,30.33 BAT1.+@2 25.72,31.1 30.6,31.1 30.9,30.8 30.9,30.3 31.1,30.1 32.8,30.1 33.4,29.5 33.5,29.5 D3.A
VDD_NRF  (via drill 0.3)
  Top 0.152: D3.C 36,29.1
  Top 0.203: v23.1,26.9 22.65,26.45 | 22.65,26.45 U3.7 | v25.8,24.1 26.45,24.1 R7.2 27.5,25.15 27.5,26.2 28.3,27 | LD1.A 29.9,25.3 | LD4.A LD3.A LD2.A LD1.A | D3.C D2.C 36,32.2 | D3.C 36.6,29.4 v37,29.8 | 28.3,27 29.1,26.2 | 29.1,26.2 29.8,25.5 LD1.A | 28.3,27 28.3,27.85 R6.2 | C8.1 22.1,27 22.65,26.45 | D3.C 34.9,29.4 v34.6,29.1 | v34.4,26.5 34.1,26.2 29.1,26.2 | 46.5,34.8 46.1,34.8 U1.9 45.7,34.8 45.4,34.8 | v44.5,39.5 44.8,39.2 44.8,35.3 45.3,34.8 45.4,34.8 | v45.5,33.1 45.3,33.3 45.3,34.7 45.4,34.8
  Bottom 0.203: v25.8,24.1 24,24.1 23.1,25 v23.1,26.9 | v37,29.8 41,33.8 44.8,33.8 v45.5,33.1 | v34.6,29.1 34.6,26.7 v34.4,26.5 | v44.5,39.5 44.8,39.2 46.9,39.2 CN3.2
VDDH  (via drill 0.3)
  Top 0.203: v43.4,36.2 43.4,36.35 U1.F4 | C1.1 46.9,32.8 v46.3,33.4
  Bottom 0.203: v43.4,36.2 43.4,34.6 43.7,34.3 45.4,34.3 v46.3,33.4

### Text on the board
tPlace: TXD | RST | PCLK | PIO | VTG | GND